# EAGLE design LineOut&Headphone (EAGLE 7.7.0)
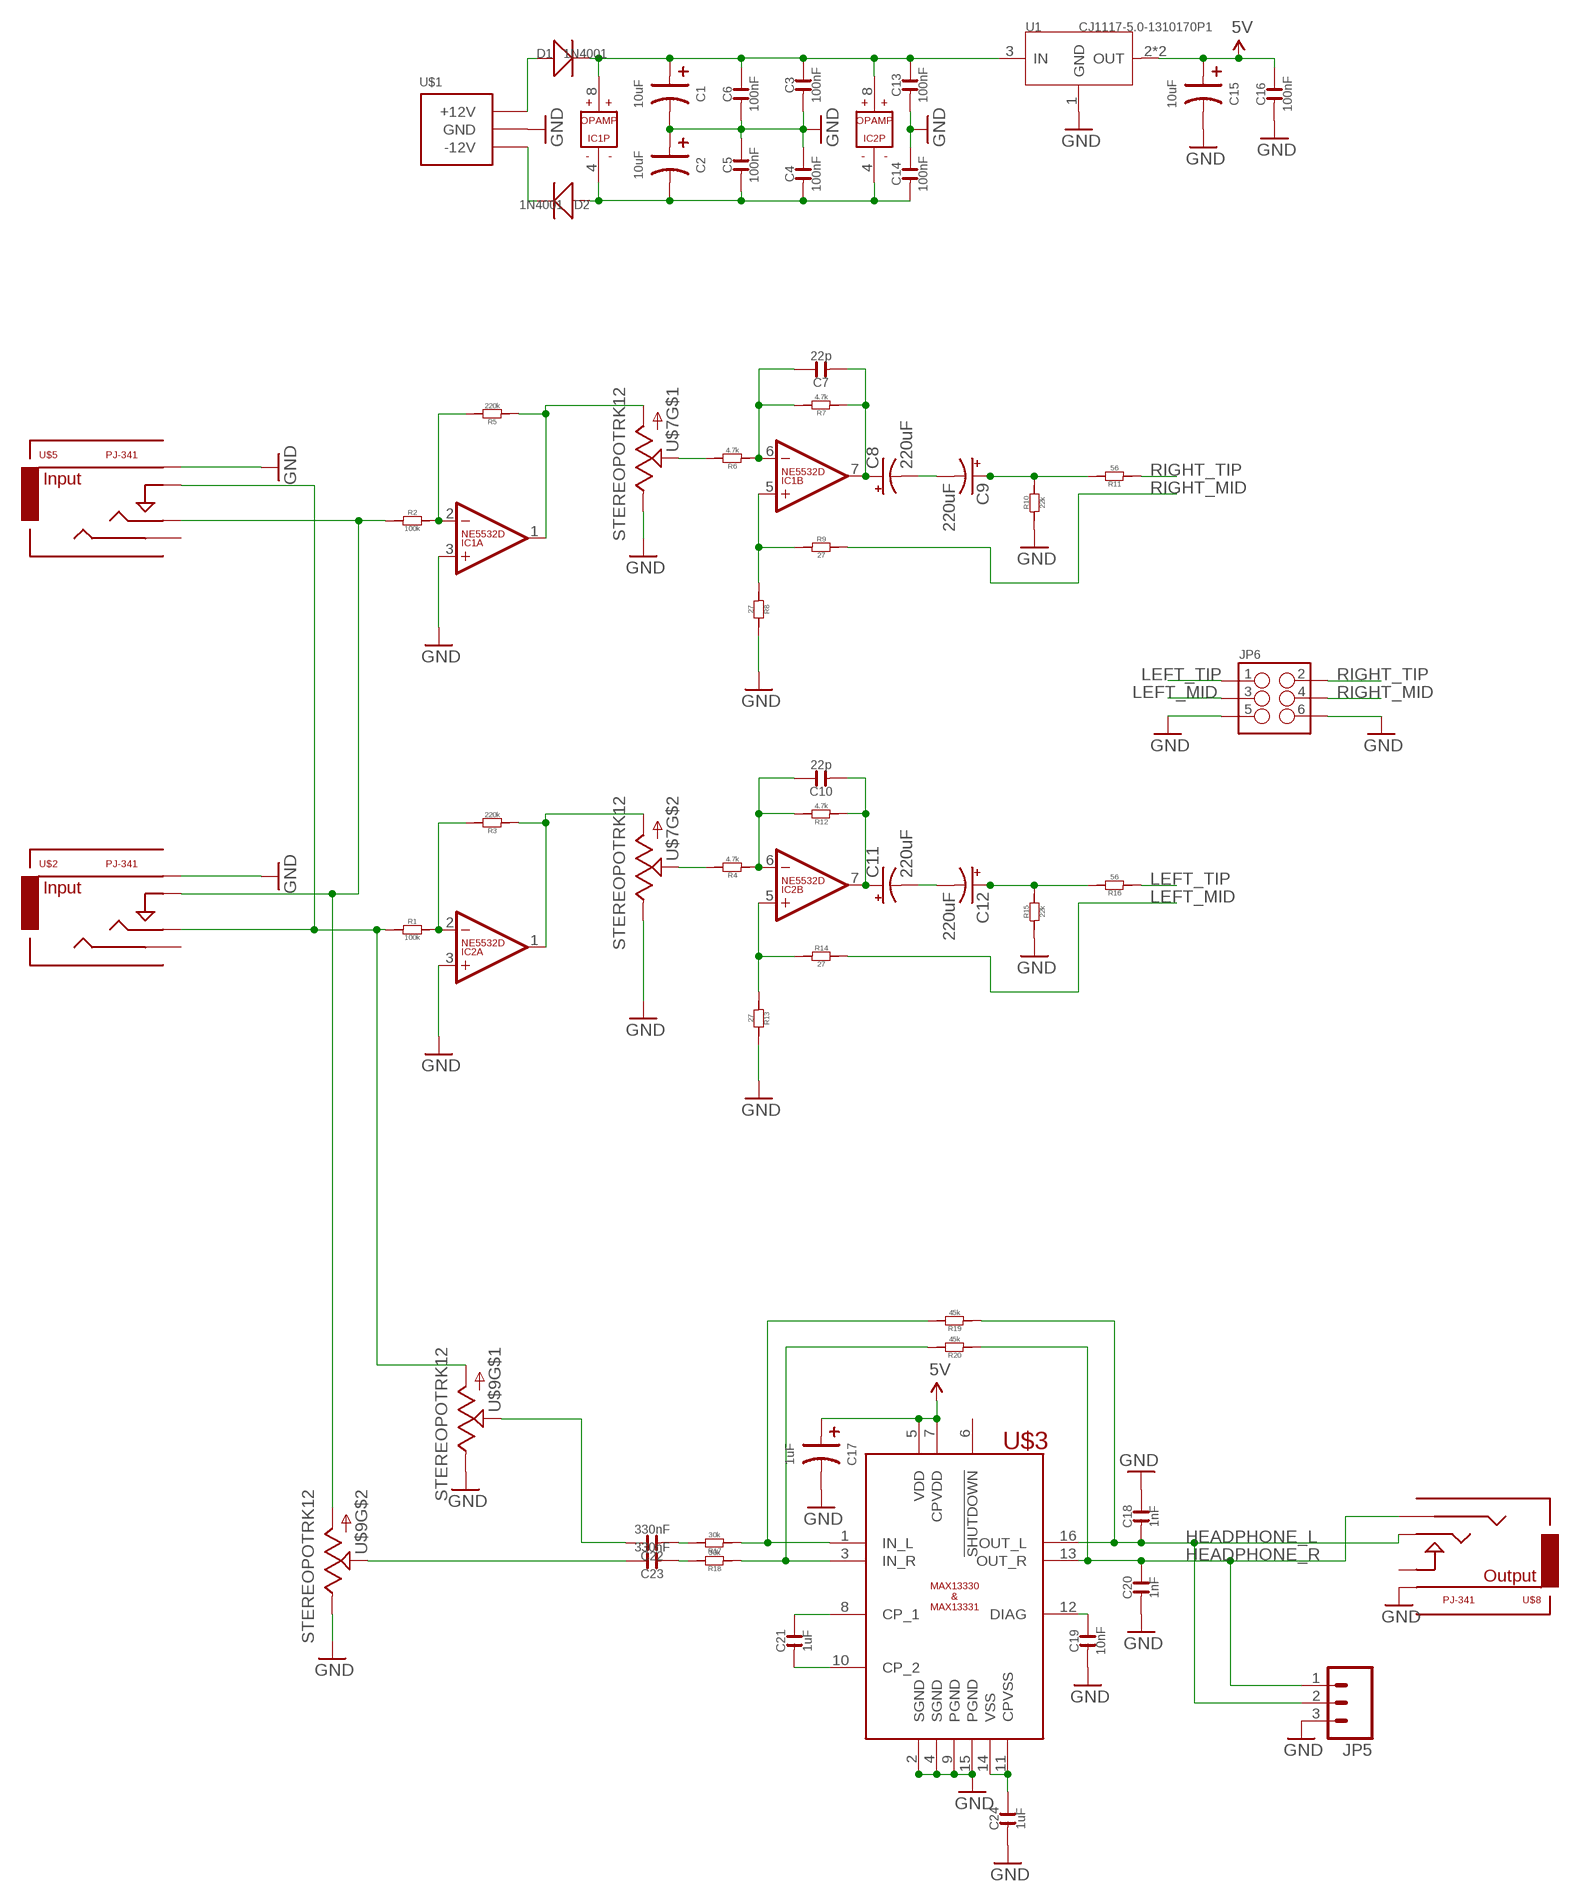
[diagram p0: schematic, sheet 1]

## Parts
C1  10uF  C-POLAR-A  [CASE-A_3216]
C2  10uF  C-POLAR-A  [CASE-A_3216]
C3  100nF  C-0603  [C0603]
C4  100nF  C-0603  [C0603]
C5  100nF  C-0603  [C0603]
C6  100nF  C-0603  [C0603]
C7  22p  C-0603  [C0603]
C8  220uF  CPOL-US153CLV-0505  [153CLV-0505]
C9  220uF  CPOL-US153CLV-0505  [153CLV-0505]
C10  22p  C-0603  [C0603]
C11  220uF  CPOL-US153CLV-0505  [153CLV-0505]
C12  220uF  CPOL-US153CLV-0505  [153CLV-0505]
C13  100nF  C-0603  [C0603]
C14  100nF  C-0603  [C0603]
C15  10uF  C-POLAR-A  [CASE-A_3216]
C16  100nF  C-0603  [C0603]
C17  1uF  C-POLAR-A  [CASE-A_3216]
C18  1nF  C-0603  [C0603]
C19  10nF  C-0603  [C0603]
C20  1nF  C-0603  [C0603]
C21  1uF  C-0603  [C0603]
C22  330nF  C-0603  [C0603]
C23  330nF  C-0603  [C0603]
C24  1uF  C-0603  [C0603]
D1  1N4001  D-SOD-123  [SOD123]
D2  1N4001  D-SOD-123  [SOD123]
IC1  NE5532D  [SO08]
IC2  NE5532D  [SO08]
JP5  M03PTH  [1X03]
JP6  M03X2  [2X3-SHROUDED]
R1  100k  R-0603  [R0603]
R2  100k  R-0603  [R0603]
R3  220k  R-0603  [R0603]
R4  4.7k  R-0603  [R0603]
R5  220k  R-0603  [R0603]
R6  4.7k  R-0603  [R0603]
R7  4.7k  R-0603  [R0603]
R8  27  R-0603  [R0603]
R9  27  R-0603  [R0603]
R10  22k  R-0603  [R0603]
R11  56  R-0603  [R0603]
R12  4.7k  R-0603  [R0603]
R13  27  R-0603  [R0603]
R14  27  R-0603  [R0603]
R15  22k  R-0603  [R0603]
R16  56  R-0603  [R0603]
R17  30k  R-0603  [R0603]
R18  30k  R-0603  [R0603]
R19  45k  R-0603  [R0603]
R20  45k  R-0603  [R0603]
U1  CJ1117-5.0-1310170P1  [SOT223]
U$1  POWER_SIMPLE10  [POWER_10]
U$2  PJ-341  AUDIO-JACKINPUT  [3.5MM-JACK-SWITCH-13MM-INPUT]
U$3  MAX13330  [QSOP16]
U$5  PJ-341  AUDIO-JACKINPUT  [3.5MM-JACK-SWITCH-13MM-INPUT]
U$7  STEREOPOTRK12  [RK12]
U$8  PJ-341  AUDIO-JACKOUTPUT  [3.5MM-JACK-SWITCH-13MM-OUTPUT]
U$9  STEREOPOTRK12  [RK12]

## Nets
5V [POWER]: C15.+ C16.2 C17.+ U1.2(OUT) U1.TER(OUT) U$3.5(VDD) U$3.7(CPVDD)
+12V [POWER]: C1.+ C3.2 C6.2 C13.2 D1.- IC1.8(P:V+) IC2.8(P:V+) U1.3(IN)
-12V [POWER]: C2.- C4.1 C5.1 C14.1 D2.+ IC1.4(P:V-) IC2.4(P:V-)
GND: C1.- C2.+ C3.1 C4.2 C5.2 C6.1 C13.1 C14.2 C15.- C16.1 C17.- C18.2 C19.1 C20.1 C24.1 IC1.3(A:+IN) IC2.3(A:+IN) JP5.3 JP6.5 JP6.6 R8.2 R10.1 R13.2 R15.1 U1.1(GND) U$1.3(GND) U$1.4(GND) U$1.5(GND) U$1.6(GND) U$1.7(GND) U$1.8(GND) U$2.RING@3(RING) U$3.2(SGND) U$3.4(SGND) U$3.9(PGND) U$3.15(PGND) U$5.RING@3(RING) U$7.R1_1(E) U$7.R2_1(E) U$8.RING@3(RING) U$9.R1_1(E) U$9.R2_1(E)
HEADPHONE_L: C18.1 JP5.2 R19.1 U$3.16(OUT_L) U$8.TIP@3(TIP)
HEADPHONE_R: C20.2 JP5.1 R20.1 U$3.13(OUT_R) U$8.SECOND@3(SECOND)
LEFT_MID: JP6.3 R14.2
LEFT_TIP: JP6.1 R16.1
N$1 [POWER]: D2.- U$1.1(-12V) U$1.2(-12V)
N$3: C9.+ R10.2 R11.2
N$4: C7.1 C8.+ IC1.7(B:OUT) R7.1
N$5: IC1.5(B:+IN) R8.1 R9.1
N$6 [POWER]: D1.+ U$1.9(+12V) U$1.10(+12V)
N$7: C7.2 IC1.6(B:-IN) R6.1 R7.2
N$8: IC1.2(A:-IN) R2.2 R5.2
N$9: IC1.1(A:OUT) R5.1 U$7.R1_3(A)
N$11: C12.+ R15.2 R16.2
N$12: R6.2 U$7.R1_2(S)
N$13: C8.- C9.-
N$14: R2.1 U$2.SWITCH@3(SWITCH) U$5.TIP@3(TIP) U$9.R2_3(A)
N$15: C10.1 C11.+ IC2.7(B:OUT) R12.1
N$16: IC2.5(B:+IN) R13.1 R14.1
N$19: C10.2 IC2.6(B:-IN) R4.1 R12.2
N$20: IC2.2(A:-IN) R1.2 R3.2
N$21: IC2.1(A:OUT) R3.1 U$7.R2_3(A)
N$22: R1.1 U$2.TIP@3(TIP) U$5.SWITCH@3(SWITCH) U$9.R1_3(A)
N$23: R4.2 U$7.R2_2(S)
N$24: C11.- C12.-
N$25: C22.2 U$9.R1_2(S)
N$26: R17.1 R19.2 U$3.1(IN_L)
N$27: C23.2 U$9.R2_2(S)
N$29: C19.2 U$3.12(DIAG)
N$30: C24.2 U$3.11(CPVSS) U$3.14(VSS)
N$31: C21.1 U$3.10(CP_2)
N$32: C21.2 U$3.8(CP_1)
N$33: C23.1 R18.2
N$34: C22.1 R17.2
N$35: R18.1 R20.2 U$3.3(IN_R)
RIGHT_MID: JP6.4 R9.2
RIGHT_TIP: JP6.2 R11.1
Unconnected: U$2.SECOND@3(SECOND) U$3.6(!SHUTDOWN) U$5.SECOND@3(SECOND) U$8.SWITCH@3(SWITCH)

## Library data of the parts
C1 C2 C15 C17 = EurorackModularParts:C-POLAR*
C3-C7 C10 C13 C14 C16 C18-C24 = OPL:C*
C8 C9 C11 C12 = adafruit:CPOL-US: POLARIZED CAPACITOR, American symbol
D1 D2 = OPL:D*: DIODE
IC1 IC2 = EurorackModularParts:NE5532: AUDIO AMPLIFIER
JP5 = SparkFun-Connectors:M03: Header 3 Standard 3-pin 0.1" header. Use with straight break away headers (SKU : PRT-00116), right angle break away headers (PRT-00553), swiss pins (PRT-00743), machine pins (PRT-00117), and female headers (PRT-00115). Molex polarized connector foot print use with SKU : PRT-08232 with associated crimp pins and housings.
JP6 = SparkFun-Connectors:M03X2: 2x3 .1" header. Shrouded, with keying- CONN-10681 SMT- CONN-11415 Pogo pins- HW-11044; PROD_ID: CONN-10681
R1-R20 = OPL:R*
U1 = OPL Eagle Library:CJ1117-5.0
U$1 = EurorackModularParts:POWER_SIMPLE
U$2 U$5 = EurorackModularParts:AUDIO-JACK: Switching Mono 3.5mm Audio Jack from Erthenvar.; DESC: Input; MPN: PJ-341
U$3 = EurorackModularParts:MAX13330
U$7 U$9 = EurorackModularParts:STEREOPOT
U$8 = EurorackModularParts:AUDIO-JACK: Switching Mono 3.5mm Audio Jack from Erthenvar.; DESC: Output; MPN: PJ-341

## Net classes
0 default: width 0.203 mm
1 POWER: width 0.305 mm

## Board
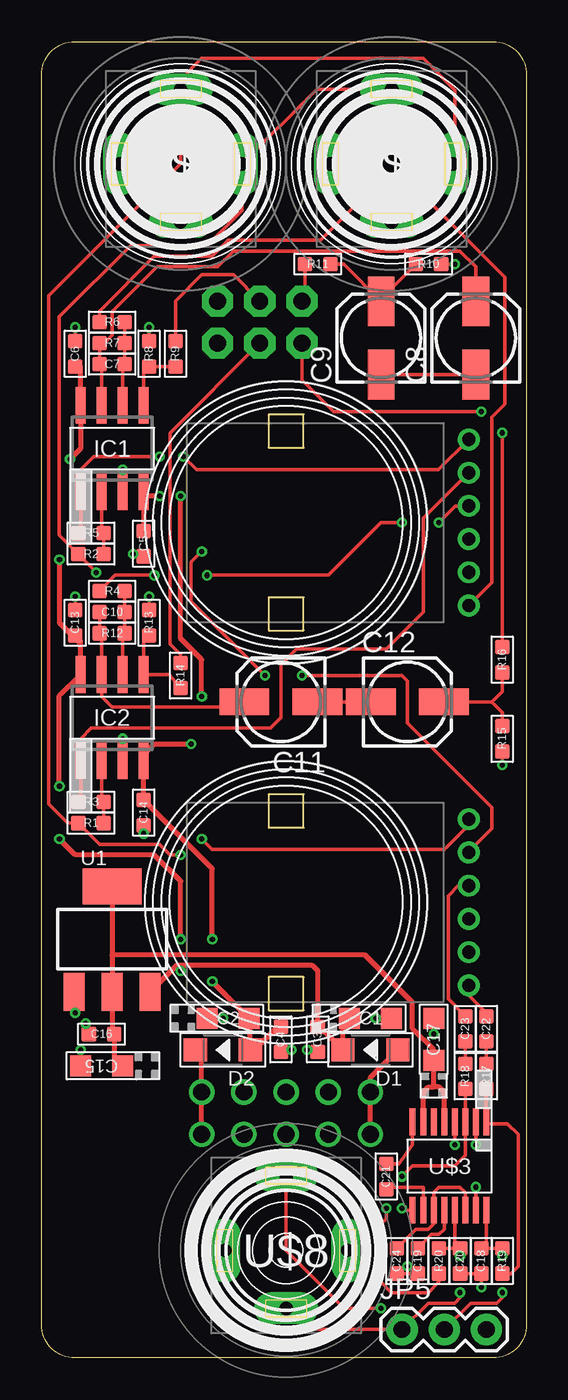
[diagram p1: board, top side]
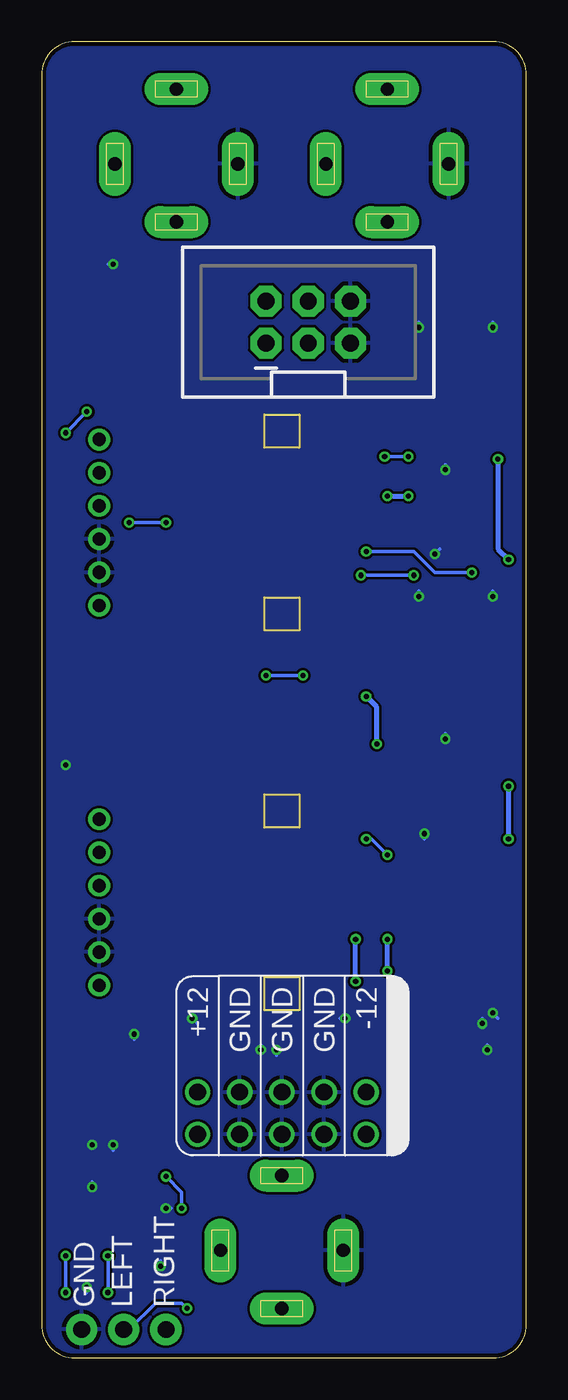
[diagram p2: board, bottom side, seen from below]

Size 29.21 x 79.25 mm. Coordinates in mm from the lower left corner, seen from the top.
Outline: 0,2 0,77.25 arc-90 2,79.25 27.21,79.25 arc-90 29.21,77.25 29.21,2 arc-90 27.21,0 2,0 arc-90 0,2
Copper layers (1*16): Top 0.035mm / dielectric 1.5mm / Bottom 0.035mm
Design rules "ITEADstudio_DRC": minimum track width 6mil, minimum drill 12mil, track to track 6mil, track to pad 6mil, pad to pad 6mil, via to via 6mil, smd to smd 0mil, copper to edge 10mil, drill to drill 10mil, minimum pad ring 10mil, minimum via ring 6mil, stop-mask expansion 2mil, vias tented up to drill 100mil, thermal gap 10mil

### Footprints (pad centres in the part's own frame; a part is rotated, then mirrored left to right if it is on the bottom)
CASE-A_3216 = smd 1.27 x 1.27: + -1.27,0; - 1.27,0
C0603 = smd 0.889 x 0.889: 1 -0.762,0; 2 0.762,0
153CLV-0505 = smd 3 x 1.6: + 2.2,0; - -2.2,0
SOD123 = smd 1.397 x 1.397: + -1.651,0; - 1.651,0
SO08 = smd 0.6 x 2.2: 1 -1.905,-2.6; 2 -0.635,-2.6; 3 0.635,-2.6; 4 1.905,-2.6; 5 1.905,2.6; 6 0.635,2.6; 7 -0.635,2.6; 8 -1.905,2.6
1X03 = drill 1.016 pad 1.88: 1 0,0; 2 2.54,0; 3 5.08,0
2X3-SHROUDED = drill 1.016 pad 1.88 octagon: 1 -1.27,2.54; 2 1.27,2.54; 3 -1.27,0; 4 1.27,0; 5 -1.27,-2.54; 6 1.27,-2.54
R0603 = smd 0.889 x 0.889: 1 -0.762,0; 2 0.762,0
SOT223 = smd 1.27 x 2.286: 1 -2.286,-3.175; 2 0,-3.175; 3 2.286,-3.175 | smd 3.556 x 2.159: TER 0,3.175
POWER_10 = drill 1.016: 1 -5.08,-1.27; 2 -5.08,1.27; 3 -2.54,-1.27; 4 -2.54,1.27; 5 0,-1.27; 6 0,1.27; 7 2.54,-1.27; 8 2.54,1.27; 9 5.08,-1.27; 10 5.08,1.27
3.5MM-JACK-SWITCH-13MM-INPUT = drill 0.8 pad 1.93 long: RING@3 -3.7,0; SECOND@3 0,-3.5; SWITCH@3 3.7,0; TIP@3 0,4.5
QSOP16 = smd 1.6 x 0.36: 1 -2.655,2.223; 2 -2.655,1.587; 3 -2.655,0.953; 4 -2.655,0.318; 5 -2.655,-0.318; 6 -2.655,-0.953; 7 -2.655,-1.587; 8 -2.655,-2.223; 9 2.655,-2.223; 10 2.655,-1.587; 11 2.655,-0.953; 12 2.655,-0.318; 13 2.655,0.318; 14 2.655,0.953; 15 2.655,1.587; 16 2.655,2.223
RK12 = drill 0.8: R1_1 -3,-11; R1_2 -5,-11; R1_3 5,-11; R2_1 -1,-11; R2_2 1,-11; R2_3 3,-11
3.5MM-JACK-SWITCH-13MM-OUTPUT = drill 0.8 pad 1.93 long: RING@3 -3.7,0; SECOND@3 0,-3.5; SWITCH@3 3.7,0; TIP@3 0,4.5

### Placement (x,y rotation side)
C1  19.81,20.45 0 top
C2  11.24,20.45 0 top
C3  16.64,19.18 90 top
C4  14.41,19.18 270 top
C5  6.16,49.02 270 top
C6  2.03,60.45 270 top
C7  4.25,59.82 0 top
C8  26.16,61.4 90 top
C9  20.45,61.4 90 top
C10  4.25,44.89 0 top
C11  14.41,39.5 180 top
C12  22.03,39.5 0 top
C13  2.03,44.26 270 top
C14  6.16,32.83 270 top
C15  3.62,17.59 180 top
C16  3.62,19.49 0 top
C17  23.62,19.18 90 top
C18  26.48,5.84 270 top
C19  22.67,5.84 90 top
C20  25.21,5.84 90 top
C21  20.76,10.92 90 top
C22  26.8,19.81 90 top
C23  25.53,19.81 90 top
C24  21.4,5.84 90 top
D1  19.81,18.54 180 top
D2  10.92,18.54 180 top
IC1  4.25,54.74 0 top
IC2  4.25,38.54 0 top
JP5  21.72,1.71 0 top
JP6  13.14,62.36 90 bottom
R1  2.98,32.19 0 top
R2  2.98,48.39 0 top
R3  2.98,33.46 0 top
R4  4.25,46.16 180 top
R5  2.98,49.66 0 top
R6  4.25,62.36 180 top
R7  4.25,61.09 0 top
R8  6.48,60.45 90 top
R9  8.06,60.45 90 top
R10  23.3,65.85 180 top
R11  16.64,65.85 0 top
R12  4.25,43.62 0 top
R13  6.48,44.26 90 top
R14  8.38,41.08 90 top
R15  27.75,37.27 90 top
R16  27.75,42.04 270 top
R17  26.8,16.95 90 top
R18  25.53,16.95 90 top
R19  27.75,5.84 270 top
R20  23.94,5.84 270 top
U1  4.25,25.21 0 top
U$1  14.73,14.73 180 bottom
U$2  8.38,71.88 0 top
U$3  24.57,11.56 270 top
U$5  21.08,71.88 0 top
U$7  14.73,50.29 90 top
U$8  14.73,6.48 0 top
U$9  14.73,27.43 90 top

### Tracks (layer width: path | path; a pad name or v marks a point on that pad's centre or on a via)
5V
  Top 0.305: U$3.7 22.99,16 23.3,16.32 23.62,16.32 | 23.62,16.32 C17.+ 23.62,18.54 22.35,19.81 22.35,21.4 19.5,24.26 4.25,24.26 | U$3.5 24.26,16 23.94,16.32 23.62,16.32 | C15.+ 4.38,18.1 C16.2 4.25,19.62 U1.2 4.25,24.26 | U1.TER 4.25,24.26
+12V  (via drill 0.3)
  Top 0.305: C6.2 2.35,59.69 IC1.8 2.35,54.74 v1.71,54.1 | C1.+ 18.16,20.07 D1.- 16.76,19.94 C3.2 16.64,23.3 16.32,23.62 8.13,23.62 | 2.35,42.99 IC2.8 1.08,39.87 v1.08,34.42 | 2.35,42.99 2.35,43.18 C13.2 | 8.13,23.62 U1.3 | v1.08,48.07 1.08,44.26 2.35,42.99 | 8.13,23.62 8.13,23.56 v8.38,23.3 | v8.38,25.21 8.38,28.7 6.79,30.29 2.03,30.29 v1.08,31.24
  Bottom 0.305: v1.71,54.1 1.71,48.7 v1.08,48.07 | v8.38,23.3 v8.38,25.21 | v1.08,31.24 v1.08,34.42
-12V  (via drill 0.3)
  Top 0.305: C5.1 IC1.4 6.42,51.88 v7.11,51.88 | C4.1 14.22,19.94 13.14,18.86 12.89,18.86 D2.+ 12.57,20.38 C2.- v10.29,22.67 | v10.29,25.21 10.29,29.46 C14.1 IC2.4 6.16,36.32 6.79,36.96 v9.02,36.96 | v9.65,39.81 9.65,42.04 8.38,43.31 v8.38,51.88
  Bottom 0.305: v10.29,22.67 v10.29,25.21 | v9.02,36.96 9.02,39.18 v9.65,39.81 | v8.38,51.88 v7.11,51.88
GND  (via drill 0.3)
  Top 0.203: U$3.2 v26.16,12.83 | U$3.4 v24.89,12.83 | U$3.9 21.83,8.9 v21.72,9.02 | U$3.15 v26.16,10.29 | C17.- v23.62,19.49 | C24.1 22.02,5.08 | 22.02,5.08 C19.1 | 22.02,5.08 v22.02,5.51 v22.04,5.53 | C20.1 C18.2 v26.48,4.25 | C3.1 16.13,18.42 v16,18.54 | C4.2 14.92,18.42 v15.05,18.54 | C1.- v20.13,20.45 | C2.+ v10.92,20.45 | C15.- v2.35,18.54 | C16.1 2.86,19.94 v2.67,20.13 | U1.1 1.97,20.83 v2.03,20.76 | R15.1 v27.75,35.69 | R10.1 v24.89,65.85 | C6.1 v2.03,62.04 | R8.2 v6.48,62.04 | IC1.3 v4.89,53.47 | R13.2 v6.48,45.85 | C5.2 5.65,48.26 v5.52,48.39 | C13.1 v2.03,45.85 | IC2.3 v4.89,37.28 | C14.2 v6.16,31.56
  Bottom 0.203: v24.89,12.83 24.89,12.51 | v21.72,9.02 21.4,9.02 | v26.16,10.29 26.16,10.6 | v23.62,19.49 23.62,19.18 | v22.04,5.53 22.04,5.84 | v26.48,4.25 26.48,3.94 | v16,18.54 16,18.86 | v15.05,18.54 15.05,18.22 | v20.13,20.45 19.81,20.13 | v10.92,20.45 11.24,20.45 | v2.35,18.54 2.35,18.86 | v2.67,20.13 2.67,20.45 | v2.03,20.76 1.71,20.45 | v24.89,65.85 25.21,65.85 | v2.03,62.04 2.03,62.36 | v6.48,62.04 6.48,62.36 | v4.89,53.47 4.89,53.78 | v6.48,45.85 6.48,46.17 | v5.52,48.39 5.21,48.7 | v2.03,45.85 2.03,46.17 | v4.89,37.28 4.89,37.59 | v6.16,31.56 6.16,31.24
  pour Bottom: -1.02,79.76 -1.02,-0.05 29.85,-0.05 29.85,79.76
HEADPHONE_L  (via drill 0.3)
  Top 0.203: U$3.16 26.8,6.92 C18.1 R19.1 v27.75,6.16 | v27.75,3.94 27.75,3.62 27.43,3.3 25.84,3.3 JP5.2 | v20.45,2.98 18.23,2.98 14.73,6.48 U$8.TIP@3
  Bottom 0.203: v27.75,6.16 v27.75,3.94 | JP5.2 23.94,1.71 22.35,3.3 20.77,3.3 v20.45,2.98
HEADPHONE_R  (via drill 0.3)
  Top 0.203: U$3.13 24.89,6.92 C20.2 | C20.2 R20.1 | C20.2 v25.21,6.16 | v25.21,3.94 25.21,3.62 24.89,3.3 23.3,3.3 JP5.1 16,1.71 U$8.SECOND@3
  Bottom 0.203: v25.21,6.16 v25.21,3.94
LEFT_MID
  Top 0.203: R14.2 8.38,42.35 7.75,42.99 7.75,55.69 JP6.3
LEFT_TIP  (via drill 0.3)
  Top 0.203: R16.1 v27.75,55.69 | v26.48,56.96 17.59,56.96 15.68,58.87 JP6.1
  Bottom 0.203: v27.75,55.69 v26.48,56.96
N$1
  Top 0.305: D2.- 9.65,18.16 U$1.1 U$1.2
N$3
  Top 0.203: R11.2 18.2,65.85 C9.+ 20.45,63.75 R10.2
N$4
  Top 0.203: IC1.7 3.62,59.82 C7.1 R7.1 3.78,61.09 4.25,61.56 4.25,62.99 6.95,65.69 10.61,65.69 11.56,66.64 25.21,66.64 26.16,65.69 C8.+
N$5
  Top 0.203: IC1.5 6.16,59.69 R8.1 R9.1
N$6
  Top 0.305: D1.+ 19.81,16.89 U$1.9 U$1.10
N$7
  Top 0.203: IC1.6 4.89,59.82 C7.2 R7.2 R6.1
N$8
  Top 0.203: IC1.2 3.62,49.78 R5.2 R2.2
N$9  (via drill 0.3)
  Top 0.203: R5.1 2.35,49.78 IC1.1 2.35,53.47 3.14,54.26 v7.11,54.26 | v8.54,54.26 9.33,53.47 23.91,53.47 U$7.R1_3
  Bottom 0.203: v8.54,54.26 v7.11,54.26
N$11
  Top 0.203: C12.+ 27.11,39.5 | 27.11,39.5 27.75,38.86 R15.2 | R16.2 27.75,40.13 27.11,39.5
N$12
  Top 0.203: R6.2 3.49,63.02 6.79,66.33 10.29,66.33 11.24,67.28 16.8,67.28 19.5,69.98 22.99,69.98 27.91,65.06 27.91,57.44 27.11,56.64 27.11,46.67 U$7.R1_2
N$13
  Top 0.203: C9.- C8.-
N$14  (via drill 0.3)
  Top 0.203: v15.68,41.09 21.72,41.09 22.04,40.77 22.04,38.23 27.11,33.15 27.11,31.88 25.73,30.49 U$9.R2_3 | v13.46,41.09 9.02,45.53 9.02,47.91 v9.65,48.55 | v3.3,47.28 3.3,47.31 R2.1 1.08,49.53 1.08,62.67 5.37,66.96 9.97,66.96 12.08,69.07 U$2.SWITCH@3 16.58,76.38 U$5.TIP@3
  Bottom 0.203: v15.68,41.09 v13.46,41.09 | v3.3,47.28 5.52,47.28 6.79,48.55 v9.65,48.55
N$15
  Top 0.203: C10.1 R12.1 3.62,43.5 IC2.7 3.62,39.81 4.25,39.18 11.9,39.18 C11.+
N$16
  Top 0.203: R14.1 7.68,41.14 IC2.5 6.16,43.18 R13.1
N$19
  Top 0.203: R4.1 C10.2 R12.2 4.89,43.5 IC2.6
N$20
  Top 0.203: IC2.2 3.62,33.59 R3.2 R1.2
N$21
  Top 0.203: R3.1 2.35,33.59 IC2.1 2.35,37.28 2.98,37.91 13.78,37.91 14.41,38.54 14.41,41.72 15.37,42.67 20.77,42.67 22.99,44.89 22.99,50.55 U$7.R2_3
N$22  (via drill 0.3)
  Top 0.203: v9.65,31.24 10.29,30.61 24.26,30.61 25.73,32.08 U$9.R1_3 | v8.38,30.29 7.75,30.29 7.11,30.92 3.49,30.92 R1.1 1.59,32.19 0.44,33.34 0.44,63.95 8.38,71.88 U$2.TIP@3 8.38,76.96 9.65,78.23 22.99,78.23 24.89,76.33 24.89,71.99 U$5.SWITCH@3
  Bottom 0.203: v9.65,31.24 9.33,31.24 v8.38,30.29
N$23  (via drill 0.3)
  Top 0.203: v6.79,47.12 4.45,47.12 R4.2 | U$7.R2_2 24.94,51.29 v23.94,50.29 | v21.72,50.29 20.45,50.29 17.27,47.12 v9.97,47.12
  Bottom 0.203: v9.97,47.12 v6.79,47.12 | v23.94,50.29 v21.72,50.29
N$24
  Top 0.203: C11.- C12.-
N$25
  Top 0.203: C22.2 26.8,20.76 25.73,21.83 U$9.R1_2
N$26
  Top 0.203: R19.2 28.26,5.08 28.7,5.53 28.7,13.46 28.07,14.1 26.91,14.1 U$3.1 R17.1
N$27
  Top 0.203: C23.2 24.49,21.61 24.49,27.82 25.1,28.43 U$9.R2_2
N$29
  Top 0.203: U$3.12 24.26,7.75 23.94,7.43 23.5,7.43 C19.2
N$30
  Top 0.203: U$3.14 25.53,9.97 25.21,10.29 23.94,10.29 23.62,9.97 U$3.11 23.62,8.06 23.3,7.75 22.54,7.75 C24.2
N$31
  Top 0.203: U$3.10 22.99,10.29 20.96,10.29 C21.1
N$32
  Top 0.203: C21.2 21.53,11.68 22.35,12.83 U$3.8
N$33
  Top 0.203: R18.2 C23.1
N$34
  Top 0.203: R17.2 C22.1
N$35  (via drill 0.3)
  Top 0.203: R18.1 U$3.3 25.53,12.19 24.89,11.56 22.35,11.56 v21.72,10.92 | R20.2 23.94,4.57 23.3,3.94 21.08,3.94 20.45,4.57 20.45,8.06 20.77,8.38 v20.77,9.02
  Bottom 0.203: v21.72,10.92 20.77,9.97 v20.77,9.02
RIGHT_MID
  Top 0.203: R9.2 8.06,63.63 9.65,65.21 11.56,65.21 JP6.4
RIGHT_TIP
  Top 0.203: R11.1 15.88,63.82 JP6.2

### Text on the board
bPlace: RIGHT | LEFT | GND